# Altium schematic sheet Schematic2.SchDoc: PCB_Winch
size A; Author: Andres Tosca; DrawnBy: Andres Tosca
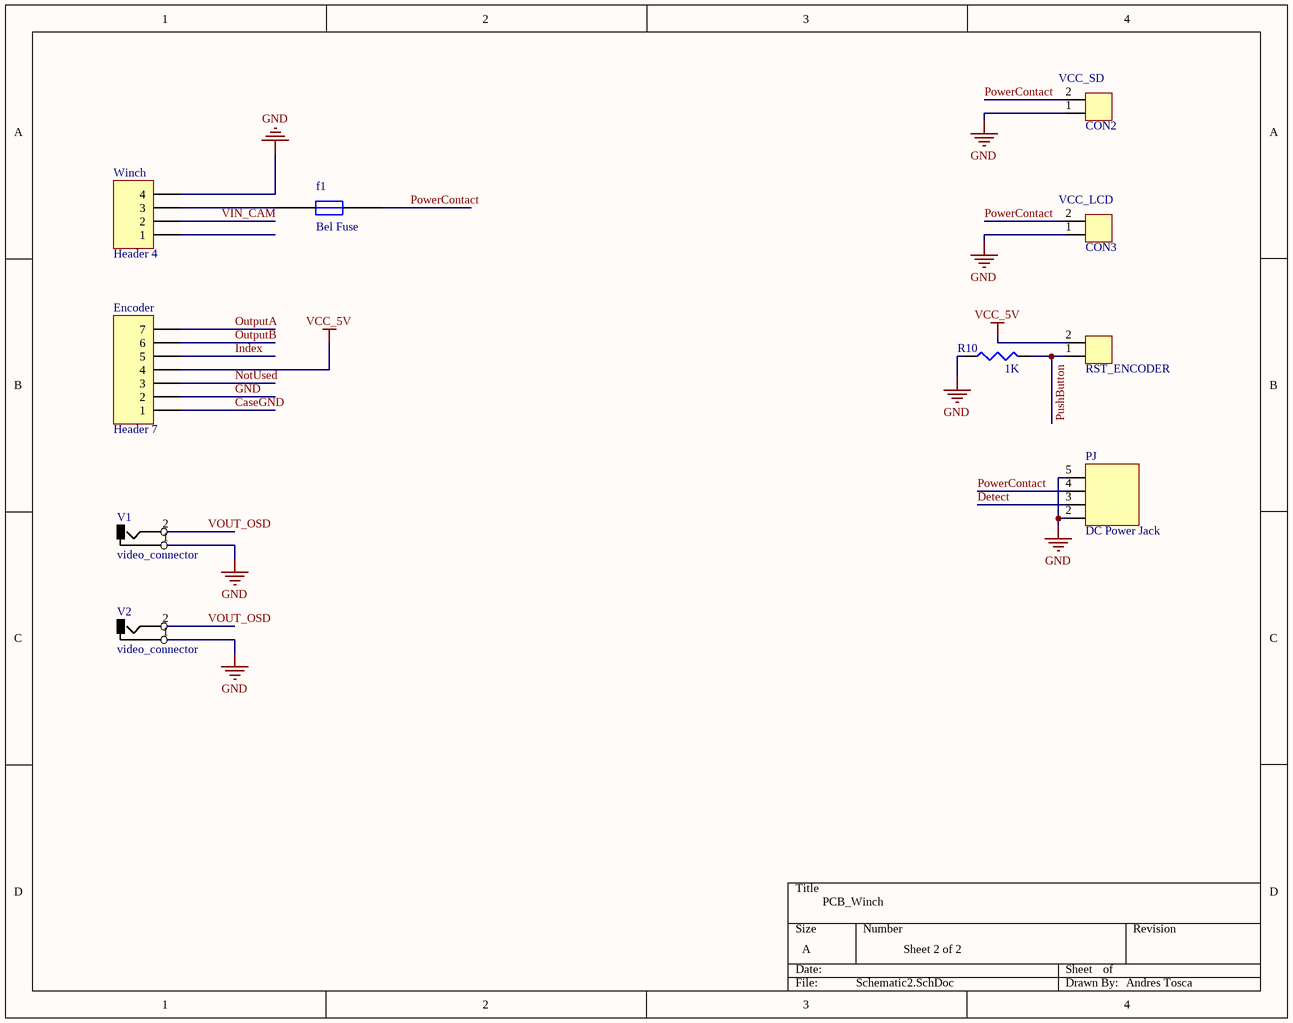
[diagram p0: Schematic2.SchDoc]

## Parts
CON2  VCC_SD  [MOLEX_2CIRCUITS]
CON3  VCC_LCD  [MOLEX_2CIRCUITS]
Encoder  Header 7  [MOLEX_7CIRCUITS]
f1  Bel Fuse  [Bel_Fuse]
PJ  DC Power Jack  [DC Power Jack TE]
R10  value 1K  [RESC2012]  (hidden comment: Res3)
RST_ENCODER  MOLEX_2circuits  [MOLEX_2CIRCUITS]  (value not drawn)
V1  video_connector  [Video Connector]
V2  video_connector  [Video Connector]
Winch  Header 4  [MOLEX_4CIRCUITS]

## Nets
GND: CON2.1 CON3.1 Encoder.2 PJ.2 PJ.5 R10.1 V1.1 V2.1 Winch.4
VCC_5V: Encoder.4 RST_ENCODER.2
CaseGND: Encoder.1
Detect: PJ.3
Index: Encoder.5
NotUsed: Encoder.3
OutputA: Encoder.7
OutputB: Encoder.6
PowerContact: CON2.2 CON3.2 f1.2 PJ.4
PushButton: R10.2 RST_ENCODER.1
VIN_CAM: Winch.2
VOUT_OSD: V1.2 V2.2
Netf1_1: f1.1 Winch.3

Not connected (* = marked no-connect by the designer): Winch 1

## Notes on the sheet
- Sheet 2 of 2

## Library data of the parts
CON2 CON3 = MOLEX_2circuits
Encoder = Header 7: Header, 7-Pin; LatestRevisionDate: 17-Jul-2002; LatestRevisionNote: Re-released for DXP Platform.; Publisher: Altium Limited
PJ = DC Power Jack TE
R10 = Res3: Resistor; Published: 8-Jun-2000; LatestRevisionDate: 29-May-2009; LatestRevisionNote: IPC-7351 Footprint Added.; PackageReference: J1-0603; Publisher: Altium Limited; PackageDescription: Chip Resistor
Winch = Header 4: Header, 4-Pin; LatestRevisionDate: 17-Jul-2002; LatestRevisionNote: Re-released for DXP Platform.; Publisher: Altium Limited